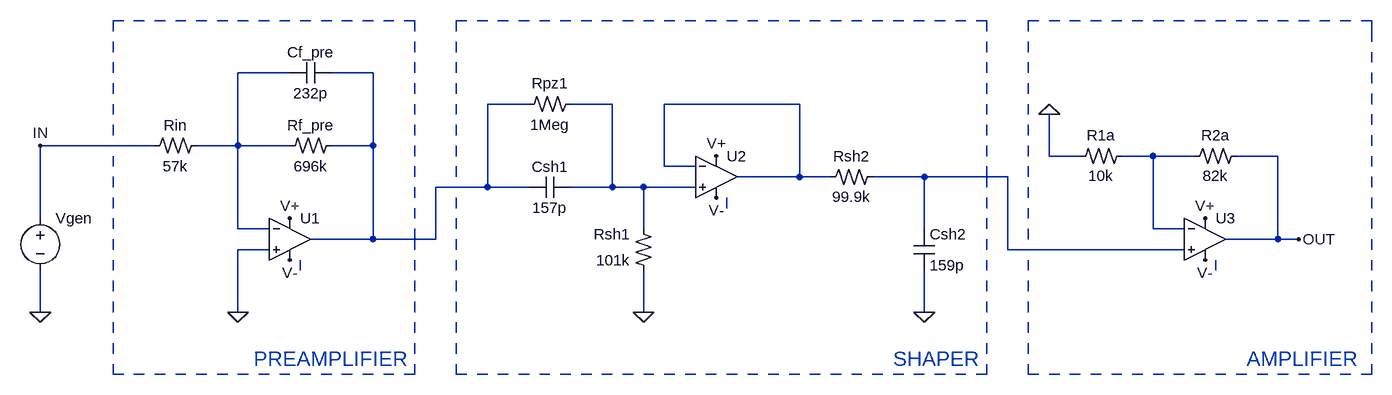
[diagram p0: schematic CATENA.asc]
CATENA.asc, the LTspice schematic file:
Version 4
SHEET 1 968 680
WIRE -992 -160 -1008 -160
WIRE -960 -160 -976 -160
WIRE -928 -160 -944 -160
WIRE -896 -160 -912 -160
WIRE -864 -160 -880 -160
WIRE -832 -160 -848 -160
WIRE -800 -160 -816 -160
WIRE -768 -160 -784 -160
WIRE -736 -160 -752 -160
WIRE -704 -160 -720 -160
WIRE -672 -160 -688 -160
WIRE -640 -160 -656 -160
WIRE -608 -160 -624 -160
WIRE -576 -160 -592 -160
WIRE -544 -160 -560 -160
WIRE -464 -160 -480 -160
WIRE -432 -160 -448 -160
WIRE -400 -160 -416 -160
WIRE -368 -160 -384 -160
WIRE -336 -160 -352 -160
WIRE -304 -160 -320 -160
WIRE -272 -160 -288 -160
WIRE -240 -160 -256 -160
WIRE -208 -160 -224 -160
WIRE -176 -160 -192 -160
WIRE -144 -160 -160 -160
WIRE -112 -160 -128 -160
WIRE -80 -160 -96 -160
WIRE -48 -160 -64 -160
WIRE -16 -160 -32 -160
WIRE 16 -160 0 -160
WIRE 48 -160 32 -160
WIRE 80 -160 64 -160
WIRE 112 -160 96 -160
WIRE 144 -160 128 -160
WIRE 176 -160 160 -160
WIRE 208 -160 192 -160
WIRE 240 -160 224 -160
WIRE 272 -160 256 -160
WIRE 304 -160 288 -160
WIRE 336 -160 320 -160
WIRE 416 -160 400 -160
WIRE 448 -160 432 -160
WIRE 480 -160 464 -160
WIRE 512 -160 496 -160
WIRE 544 -160 528 -160
WIRE 576 -160 560 -160
WIRE 608 -160 592 -160
WIRE 640 -160 624 -160
WIRE 672 -160 656 -160
WIRE 704 -160 688 -160
WIRE 736 -160 720 -160
WIRE 768 -160 752 -160
WIRE 800 -160 784 -160
WIRE 832 -160 816 -160
WIRE 864 -160 848 -160
WIRE 896 -160 880 -160
WIRE 928 -160 912 -160
WIRE -1008 -144 -1008 -160
WIRE -544 -144 -544 -160
WIRE -480 -144 -480 -160
WIRE 336 -144 336 -160
WIRE 400 -144 400 -160
WIRE 928 -128 928 -160
WIRE -1008 -112 -1008 -128
WIRE -544 -112 -544 -128
WIRE -480 -112 -480 -128
WIRE 336 -112 336 -128
WIRE 400 -112 400 -128
WIRE 928 -96 928 -112
WIRE -1008 -80 -1008 -96
WIRE -736 -80 -816 -80
WIRE -608 -80 -672 -80
WIRE -544 -80 -544 -96
WIRE -480 -80 -480 -96
WIRE 336 -80 336 -96
WIRE 400 -80 400 -96
WIRE 928 -64 928 -80
WIRE -1008 -48 -1008 -64
WIRE -544 -48 -544 -64
WIRE -480 -48 -480 -64
WIRE 336 -48 336 -64
WIRE 400 -48 400 -64
WIRE -368 -32 -432 -32
WIRE -240 -32 -304 -32
WIRE 48 -32 -160 -32
WIRE 928 -32 928 -48
WIRE -1008 -16 -1008 -32
WIRE -544 -16 -544 -32
WIRE -480 -16 -480 -32
WIRE 336 -16 336 -32
WIRE 400 -16 400 -32
WIRE 928 0 928 -16
WIRE -1008 16 -1008 0
WIRE -544 16 -544 0
WIRE -480 16 -480 0
WIRE 336 16 336 0
WIRE 400 16 400 0
WIRE -944 32 -1120 32
WIRE -816 32 -816 -80
WIRE -816 32 -880 32
WIRE -736 32 -816 32
WIRE -608 32 -608 -80
WIRE -608 32 -672 32
WIRE 928 32 928 16
WIRE -544 48 -544 32
WIRE -480 48 -480 32
WIRE 336 48 336 32
WIRE 400 48 400 32
WIRE 432 48 432 -16
WIRE 480 48 432 48
WIRE 592 48 544 48
WIRE 656 48 592 48
WIRE 784 48 720 48
WIRE -1008 64 -1008 48
WIRE -160 64 -160 -32
WIRE -112 64 -160 64
WIRE 928 64 928 48
WIRE -544 80 -544 64
WIRE -480 80 -480 64
WIRE 48 80 48 -32
WIRE 48 80 -48 80
WIRE 96 80 48 80
WIRE 240 80 160 80
WIRE 368 80 240 80
WIRE 400 80 400 64
WIRE -1008 96 -1008 80
WIRE -432 96 -432 -32
WIRE -432 96 -512 96
WIRE -368 96 -432 96
WIRE -240 96 -240 -32
WIRE -240 96 -304 96
WIRE -192 96 -240 96
WIRE -112 96 -192 96
WIRE 336 96 336 64
WIRE 928 96 928 80
WIRE -544 112 -544 96
WIRE 400 112 400 96
WIRE -1008 128 -1008 112
WIRE -480 128 -480 112
WIRE -64 128 -64 112
WIRE 336 128 336 112
WIRE 928 128 928 112
WIRE -1120 144 -1120 32
WIRE -544 144 -544 128
WIRE 400 144 400 128
WIRE -1008 160 -1008 144
WIRE -816 160 -816 32
WIRE -768 160 -816 160
WIRE -480 160 -480 144
WIRE -192 160 -192 96
WIRE 240 160 240 80
WIRE 336 160 336 144
WIRE 592 160 592 48
WIRE 640 160 592 160
WIRE 928 160 928 144
WIRE -608 176 -608 32
WIRE -608 176 -704 176
WIRE -512 176 -512 96
WIRE -512 176 -608 176
WIRE 400 176 400 160
WIRE 784 176 784 48
WIRE 784 176 704 176
WIRE 816 176 784 176
WIRE -1008 192 -1008 176
WIRE -768 192 -816 192
WIRE -544 192 -544 160
WIRE -480 192 -480 176
WIRE 336 192 336 176
WIRE 368 192 368 80
WIRE 640 192 368 192
WIRE 928 192 928 176
WIRE -1008 224 -1008 208
WIRE -720 224 -720 208
WIRE -544 224 -544 208
WIRE -480 224 -480 208
WIRE 336 224 336 208
WIRE 400 224 400 208
WIRE 688 224 688 208
WIRE 928 224 928 208
WIRE -1008 256 -1008 240
WIRE -544 256 -544 240
WIRE -480 256 -480 240
WIRE 336 256 336 240
WIRE 400 256 400 240
WIRE 928 256 928 240
WIRE -1120 288 -1120 224
WIRE -1008 288 -1008 272
WIRE -816 288 -816 192
WIRE -544 288 -544 272
WIRE -480 288 -480 272
WIRE -192 288 -192 224
WIRE 240 288 240 224
WIRE 336 288 336 272
WIRE 400 288 400 272
WIRE 928 288 928 272
WIRE -1008 320 -1008 304
WIRE -544 320 -544 304
WIRE -480 320 -480 304
WIRE 336 320 336 304
WIRE 400 320 400 304
WIRE 928 320 928 304
WIRE -1008 352 -1008 336
WIRE -544 352 -544 336
WIRE -480 352 -480 336
WIRE 336 352 336 336
WIRE 400 352 400 336
WIRE 928 352 928 336
WIRE -1008 384 -1008 368
WIRE -992 384 -1008 384
WIRE -960 384 -976 384
WIRE -928 384 -944 384
WIRE -896 384 -912 384
WIRE -864 384 -880 384
WIRE -832 384 -848 384
WIRE -800 384 -816 384
WIRE -768 384 -784 384
WIRE -736 384 -752 384
WIRE -704 384 -720 384
WIRE -672 384 -688 384
WIRE -640 384 -656 384
WIRE -608 384 -624 384
WIRE -576 384 -592 384
WIRE -544 384 -544 368
WIRE -544 384 -560 384
WIRE -480 384 -480 368
WIRE -464 384 -480 384
WIRE -432 384 -448 384
WIRE -400 384 -416 384
WIRE -368 384 -384 384
WIRE -336 384 -352 384
WIRE -304 384 -320 384
WIRE -272 384 -288 384
WIRE -240 384 -256 384
WIRE -208 384 -224 384
WIRE -176 384 -192 384
WIRE -144 384 -160 384
WIRE -112 384 -128 384
WIRE -80 384 -96 384
WIRE -48 384 -64 384
WIRE -16 384 -32 384
WIRE 16 384 0 384
WIRE 48 384 32 384
WIRE 80 384 64 384
WIRE 112 384 96 384
WIRE 144 384 128 384
WIRE 176 384 160 384
WIRE 208 384 192 384
WIRE 240 384 224 384
WIRE 272 384 256 384
WIRE 304 384 288 384
WIRE 336 384 336 368
WIRE 336 384 320 384
WIRE 400 384 400 368
WIRE 416 384 400 384
WIRE 448 384 432 384
WIRE 480 384 464 384
WIRE 512 384 496 384
WIRE 544 384 528 384
WIRE 576 384 560 384
WIRE 608 384 592 384
WIRE 640 384 624 384
WIRE 672 384 656 384
WIRE 704 384 688 384
WIRE 736 384 720 384
WIRE 768 384 752 384
WIRE 800 384 784 384
WIRE 832 384 816 384
WIRE 864 384 848 384
WIRE 896 384 880 384
WIRE 928 384 928 368
WIRE 928 384 912 384
FLAG -816 288 0
FLAG -1120 32 IN
FLAG -736 208 V-
FLAG -736 144 V+
FLAG -1120 288 0
FLAG -80 112 V-
FLAG -80 48 V+
FLAG -192 288 0
FLAG 240 288 0
FLAG 672 208 V-
FLAG 672 144 V+
FLAG 432 -16 0
FLAG 816 176 OUT
SYMBOL Opamps/UniversalOpamp2 -736 176 R0
SYMATTR InstName U1
SYMBOL res2 -880 16 R90
WINDOW 0 0 32 VBottom 2
WINDOW 3 32 32 VTop 2
SYMATTR InstName Rin
SYMATTR Value 57k
SYMBOL res2 -672 16 R90
WINDOW 0 0 32 VBottom 2
WINDOW 3 32 32 VTop 2
SYMATTR InstName Rf_pre
SYMATTR Value 696k
SYMBOL voltage -1120 128 R0
WINDOW 3 -165 -388 Invisible 2
WINDOW 39 0 0 Left 0
SYMATTR Value PULSE(0 1 1k 0 0 0 1m)
SYMATTR Value2 AC 1 0
SYMATTR InstName Vgen
SYMBOL cap -672 -96 R90
WINDOW 0 0 32 VBottom 2
WINDOW 3 32 32 VTop 2
SYMATTR InstName Cf_pre
SYMATTR Value 232p
SYMBOL Opamps/UniversalOpamp2 -80 80 R0
SYMATTR InstName U2
SYMBOL cap -304 80 R90
WINDOW 0 0 32 VBottom 2
WINDOW 3 32 32 VTop 2
SYMATTR InstName Csh1
SYMATTR Value 157p
SYMBOL res2 -176 224 R180
WINDOW 0 36 56 Left 2
WINDOW 3 36 16 Left 2
SYMATTR InstName Rsh1
SYMATTR Value 101k
SYMBOL res2 160 64 R90
WINDOW 0 0 32 VBottom 2
WINDOW 3 31 32 VTop 2
SYMATTR InstName Rsh2
SYMATTR Value 99.9k
SYMBOL cap 224 160 R0
SYMATTR InstName Csh2
SYMATTR Value 159p
SYMBOL res2 -304 -48 R90
WINDOW 0 0 32 VBottom 2
WINDOW 3 32 32 VTop 2
SYMATTR InstName Rpz1
SYMATTR Value 1Meg
SYMBOL Opamps/UniversalOpamp2 672 176 R0
SYMATTR InstName U3
SYMBOL res2 544 32 R90
WINDOW 0 0 32 VBottom 2
WINDOW 3 31 32 VTop 2
SYMATTR InstName R1a
SYMATTR Value 10k
SYMBOL res2 720 32 R90
WINDOW 0 0 32 VBottom 2
WINDOW 3 31 32 VTop 2
SYMATTR InstName R2a
SYMATTR Value 82k
TEXT -792 360 Left 3 ;PREAMPLIFIER
TEXT 192 360 Left 3 ;SHAPER
TEXT 736 360 Left 3 ;AMPLIFIER

The netlist it stands for:
* CATENA.asc
XU1 0 N066 V+ V- N067 level.2 Avol=1Meg GBW=10Meg Slew=10Meg ilimit=25m rail=0 Vos=0 phimargin=45 en=0 enk=0 in=0 ink=0 Rin=500Meg  ; pins IN+ IN- V+ V- OUT
Rin N066 IN 57k
Rf_pre N067 N066 696k
Vgen IN 0 PULSE(0 1 1k 0 0 0 1m) AC 1 0
Cf_pre N067 N066 232p
XU2 N078 N079 V+ V- N079 level.2 Avol=1Meg GBW=10Meg Slew=10Meg ilimit=25m rail=0 Vos=0 phimargin=45 en=0 enk=0 in=0 ink=0 Rin=500Meg  ; pins IN+ IN- V+ V- OUT
Csh1 N078 N067 157p
Rsh1 0 N078 101k
Rsh2 N102 N079 99.9k
Csh2 N102 0 159p
Rpz1 N078 N067 1Meg
XU3 N102 N097 V+ V- OUT level.2 Avol=1Meg GBW=10Meg Slew=10Meg ilimit=25m rail=0 Vos=0 phimargin=45 en=0 enk=0 in=0 ink=0 Rin=500Meg  ; pins IN+ IN- V+ V- OUT
R1a N097 0 10k
R2a OUT N097 82k
* PREAMPLIFIER
* SHAPER
* AMPLIFIER
.lib UniversalOpamps2.sub
.backanno
.end